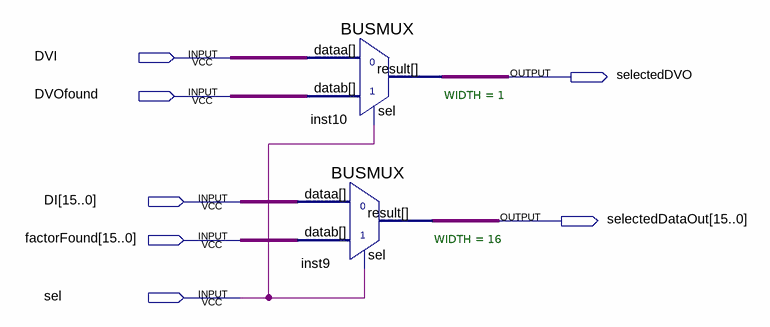
[diagram p0: schematic sheet]
// Quartus schematic wb_filt_bypassMux.bdf as structural Verilog: 2 symbols, 7 pins
module wb_filt_bypassMux (
  input  DVI,
  input  DVOfound,
  input  [15:0] DI,
  input  [15:0] factorFound,
  input  sel,
  output selectedDVO,
  output [15:0] selectedDataOut
);

  BUSMUX #(.WIDTH(1)) inst10 (.datab(DVOfound), .sel(sel), .dataa(DVI), .result(selectedDVO));
  BUSMUX #(.WIDTH(16)) inst9 (.datab(factorFound), .sel(sel), .dataa(DI), .result(selectedDataOut));
endmodule
